# Altium schematic sheet Main.SchDoc
size A3
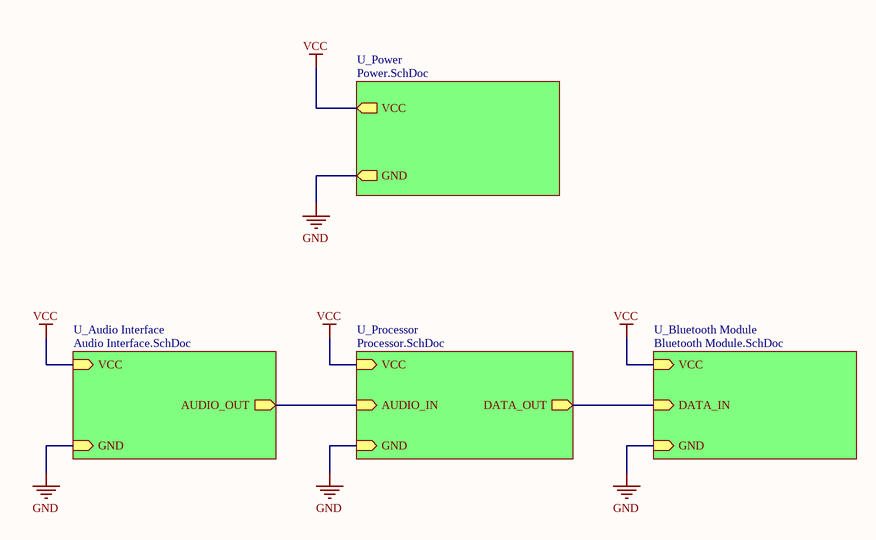
[diagram p0: Main.SchDoc]

## Sub-sheets
U_Audio Interface = Audio Interface.SchDoc: VCC (in), GND (in), AUDIO_OUT (out)
U_Bluetooth Module = Bluetooth Module.SchDoc: VCC (in), DATA_IN (in), GND (in)
U_Power = Power.SchDoc: GND (out), VCC (out)
U_Processor = Processor.SchDoc: VCC (in), GND (in), AUDIO_IN (in), DATA_OUT (out)

## Nets
GND: sheet U_Audio Interface/GND, sheet U_Bluetooth Module/GND, sheet U_Power/GND, sheet U_Processor/GND
VCC: sheet U_Audio Interface/VCC, sheet U_Bluetooth Module/VCC, sheet U_Power/VCC, sheet U_Processor/VCC
(unnamed): sheet U_Audio Interface/AUDIO_OUT, sheet U_Processor/AUDIO_IN
(unnamed): sheet U_Bluetooth Module/DATA_IN, sheet U_Processor/DATA_OUT